# EAGLE design core XX8 THT (EAGLE 6.3)
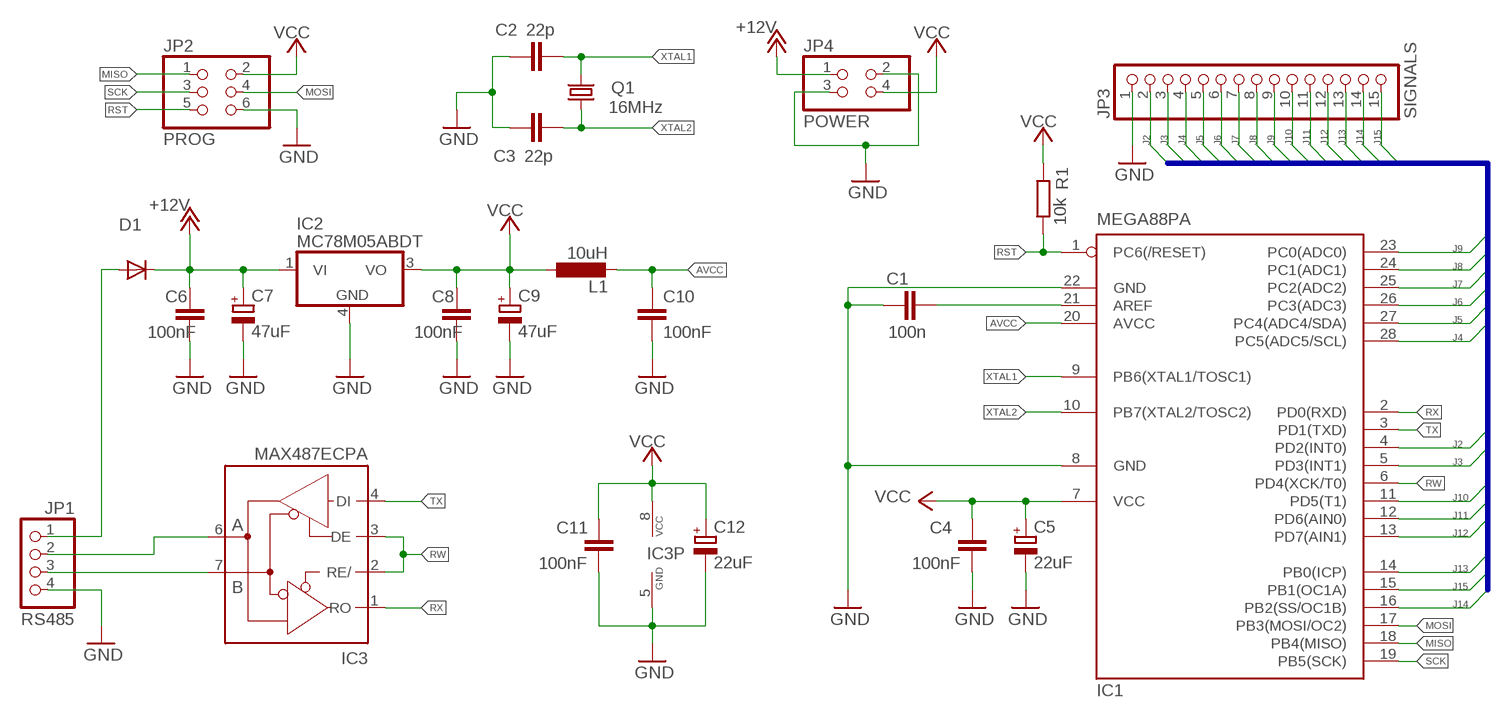
[diagram p0: schematic, sheet 1]

## Parts
C1  100n  C-EU025-024X044  [C025-024X044]
C2  22p  C-EU025-024X044  [C025-024X044]
C3  22p  C-EU025-024X044  [C025-024X044]
C4  100nF  C-EU025-025X050  [C025-025X050]
C5  22uF  CPOL-EUE2-5  [E2-5]
C6  100nF  C-EU025-025X050  [C025-025X050]
C7  47uF  CPOL-EUE2.5-6  [E2,5-6]
C8  100nF  C-EU025-025X050  [C025-025X050]
C9  47uF  CPOL-EUE2.5-6  [E2,5-6]
C10  100nF  C-EU025-025X050  [C025-025X050]
C11  100nF  C-EU025-025X050  [C025-025X050]
C12  22uF  CPOL-EUE2-5  [E2-5]
D1  1N4002  BAS15  [DO34-7]
IC1  MEGA88PA  MEGA8-P  [DIL28-3]
IC2  MC78M05ABDT  [DPACK_3]
IC3  MAX487ECPA  MAX481CPA  [DIL08]
JP1  RS485  PINHD-1X4  [1X04]
JP2  PROG  PINHD-2X3  [2X03]
JP3  SIGNALS  PINHD-1X15  [1X15]
JP4  POWER  PINHD-2X2  [2X02]
L1  10uH  L-EU0207/12  [0207/12]
Q1  16MHz  CRYSTALHC49S  [HC49/S]
R1  10k  R-EU_0204/2V  [0204V]

## Nets
+12V: C6.1 C7.+ D1.C IC2.1(VI) JP4.1
AVCC: C10.1 IC1.20(AVCC) L1.2
GND: C1.1 C2.1 C3.1 C4.2 C5.- C6.2 C7.- C8.2 C9.- C10.2 C11.2 C12.- IC1.8(GND) IC1.22(GND) IC2.4(GND) IC3.5(GND) JP1.4 JP2.6 JP3.1 JP4.2 JP4.3
J2: IC1.4(PD2(INT0)) JP3.2
J3: IC1.5(PD3(INT1)) JP3.3
J4: IC1.28(PC5(ADC5/SCL)) JP3.4
J5: IC1.27(PC4(ADC4/SDA)) JP3.5
J6: IC1.26(PC3(ADC3)) JP3.6
J7: IC1.25(PC2(ADC2)) JP3.7
J8: IC1.24(PC1(ADC1)) JP3.8
J9: IC1.23(PC0(ADC0)) JP3.9
J10: IC1.11(PD5(T1)) JP3.10
J11: IC1.12(PD6(AIN0)) JP3.11
J12: IC1.13(PD7(AIN1)) JP3.12
J13: IC1.14(PB0(ICP)) JP3.13
J14: IC1.16(PB2(SS/OC1B)) JP3.14
J15: IC1.15(PB1(OC1A)) JP3.15
MISO: IC1.18(PB4(MISO)) JP2.1
MOSI: IC1.17(PB3(MOSI/OC2)) JP2.4
N$2: C1.2 IC1.21(AREF)
N$3: D1.A JP1.1
N$4: IC3.7(B) JP1.3
N$5: IC3.6(A) JP1.2
RST: IC1.1(PC6(/RESET)) JP2.5 R1.1
RW: IC1.6(PD4(XCK/T0)) IC3.2(RE/) IC3.3(DE)
RX: IC1.2(PD0(RXD)) IC3.1(RO)
SCK: IC1.19(PB5(SCK)) JP2.3
TX: IC1.3(PD1(TXD)) IC3.4(DI)
VCC: C4.1 C5.+ C8.1 C9.+ C11.1 C12.+ IC1.7(VCC) IC2.3(VO) IC3.8(VCC) JP2.2 JP4.4 L1.1 R1.2
XTAL1: C2.2 IC1.9(PB6(XTAL1/TOSC1)) Q1.2
XTAL2: C3.2 IC1.10(PB7(XTAL2/TOSC2)) Q1.1

## Buses
J[2..15]

## Library data of the parts
C1-C4 C6 C8 C10 C11 = rcl:C-EU: CAPACITOR, European symbol
C5 C7 C9 C12 = rcl:CPOL-EU: POLARIZED CAPACITOR, European symbol
D1 = diode:BAS15: DIODE high speed
IC1 = atmel:MEGA8-P: MICROCONTROLLER 8 Kbytes FLASH, 1 kbytes SRAM, 512 bytes EEPROM, USART, 4-channel 10 bit ADC, 2-channel 8 bit ADC Pin compatible with Atmega48, ATMega88, ATMega168 Source: avr.lbr; OC_FARNELL: unknown; OC_NEWARK: unknown
IC2 = linear:MC78M: 500 mA Positive Voltage Regulators Source: Data sheet <http://www.onsemi.com/pub_link/Collateral/MC78M00-D.PDF>
IC3 = maxim:MAX481CPA: RS485 TRANSEIVER; MPN: MAX481CPA+; OC_FARNELL: unknown; OC_NEWARK: 99K3445
JP1 = pinhead:PINHD-1X4: PIN HEADER
JP2 = pinhead:PINHD-2X3: PIN HEADER
JP3 = pinhead:PINHD-1X15: PIN HEADER
JP4 = pinhead:PINHD-2X2: PIN HEADER
L1 = rcl:L-EU: INDUCTOR, European symbol
Q1 = crystal:CRYSTAL: CRYSTAL; OC_FARNELL: 1667008; OC_NEWARK: unknown
R1 = rcl:R-EU_: RESISTOR, European symbol

## Board
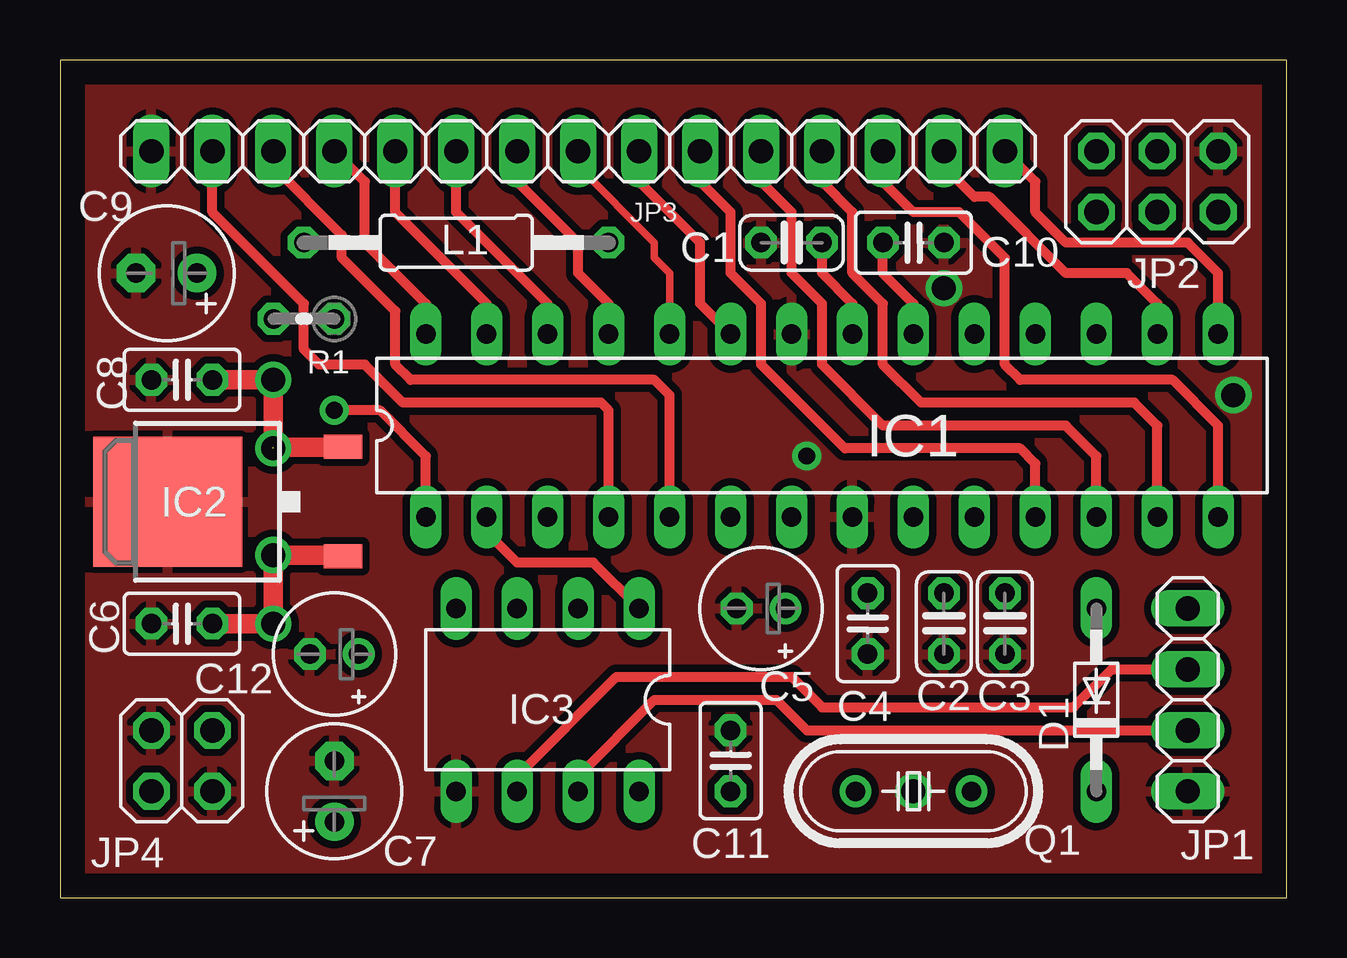
[diagram p1: board, top side]
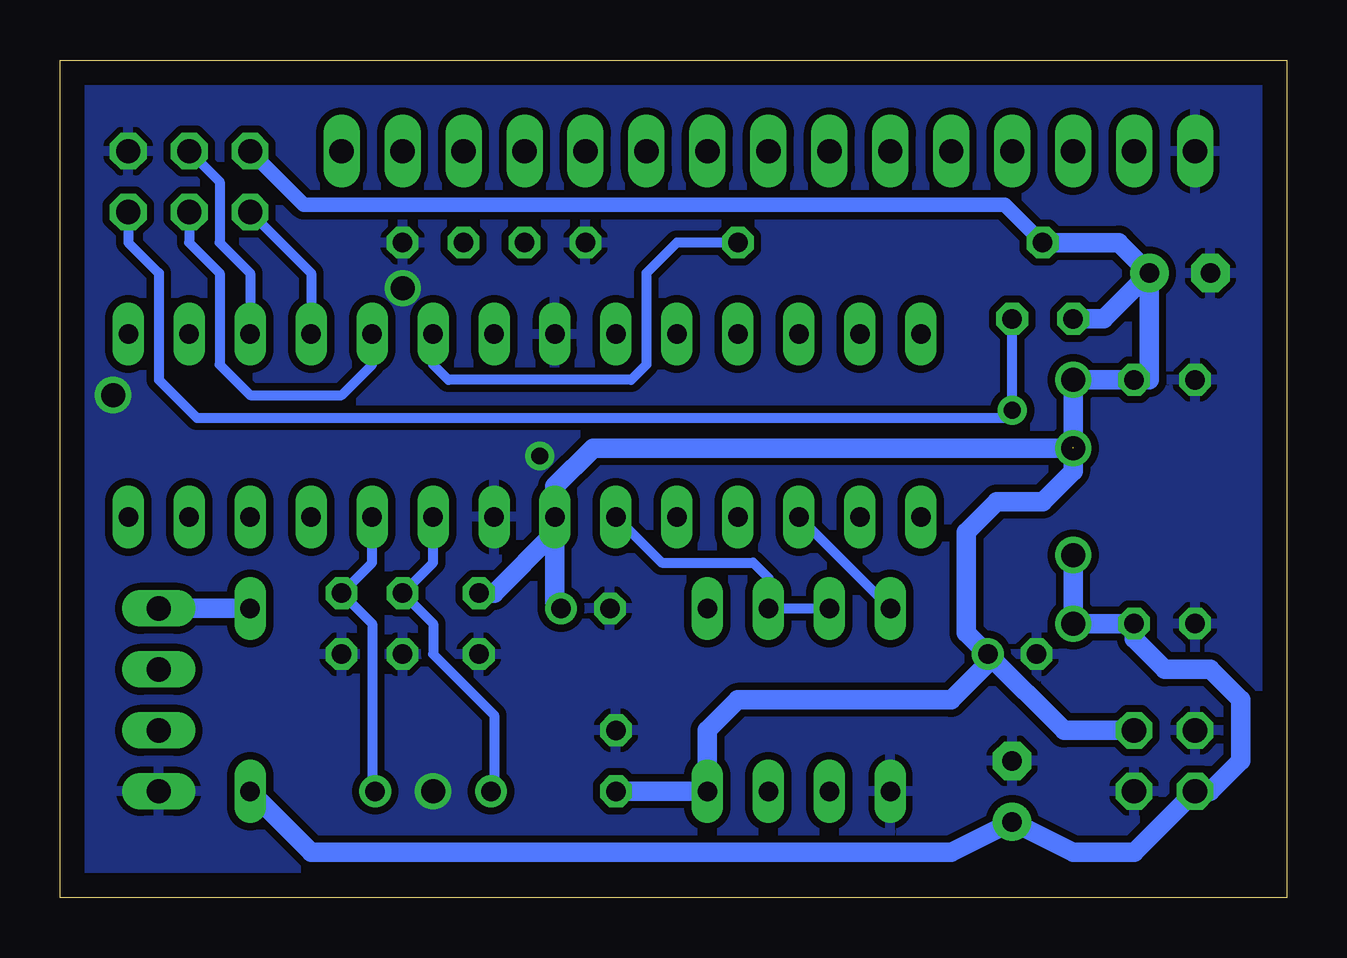
[diagram p2: board, bottom side, seen from below]

Size 51.1 x 34.91 mm. Coordinates in mm from the lower left corner, seen from the top.
Outline: 0,0 51.1,0 51.1,34.91 0,34.91 0,0
Copper layers (1*16): Top 0.035mm / dielectric 1.5mm / Bottom 0.035mm
Design rules: minimum track width 12mil, minimum drill 24mil, track to track 12mil, track to pad 12mil, pad to pad 12mil, via to via 12mil, smd to smd 8mil, copper to edge 40mil, drill to drill 12mil, minimum pad ring 10mil, minimum via ring 10mil, stop-mask expansion 4mil, vias tented up to drill 0mil, thermal gap 10mil

### Footprints (pad centres in the part's own frame; a part is rotated, then mirrored left to right if it is on the bottom)
C025-024X044 = drill 0.813 octagon: 1 -1.27,0; 2 1.27,0
C025-025X050 = drill 0.813 octagon: 1 -1.27,0; 2 1.27,0
E2-5 = drill 0.813 pad 1.27: + -1.016,0 | drill 0.813 pad 1.27 octagon: - 1.016,0
E2,5-6 = drill 0.813 pad 1.6: + -1.27,0 | drill 0.813 pad 1.6 octagon: - 1.27,0
DO34-7 = drill 0.813 long: A 3.81,0; C -3.81,0
DIL28-3 = drill 0.813 long: 1 -16.51,-3.81; 2 -13.97,-3.81; 3 -11.43,-3.81; 4 -8.89,-3.81; 5 -6.35,-3.81; 6 -3.81,-3.81; 7 -1.27,-3.81; 8 1.27,-3.81; 9 3.81,-3.81; 10 6.35,-3.81; 11 8.89,-3.81; 12 11.43,-3.81; 13 13.97,-3.81; 14 16.51,-3.81; 15 16.51,3.81; 16 13.97,3.81; 17 11.43,3.81; 18 8.89,3.81; 19 6.35,3.81; 20 3.81,3.81; 21 1.27,3.81; 22 -1.27,3.81; 23 -3.81,3.81; 24 -6.35,3.81; 25 -8.89,3.81; 26 -11.43,3.81; 27 -13.97,3.81; 28 -16.51,3.81
DPACK_3 = smd 1 x 1.6: 1 -2.28,-4.8; 3 2.28,-4.8 | smd 5.4 x 6.2: 4 0,2.5
DIL08 = drill 0.813 long: 1 -3.81,-3.81; 2 -1.27,-3.81; 3 1.27,-3.81; 4 3.81,-3.81; 5 3.81,3.81; 6 1.27,3.81; 7 -1.27,3.81; 8 -3.81,3.81
1X04 = drill 1.016 long: 1 -3.81,0; 2 -1.27,0; 3 1.27,0; 4 3.81,0
2X03 = drill 1.016 octagon: 1 -2.54,-1.27; 2 -2.54,1.27; 3 0,-1.27; 4 0,1.27; 5 2.54,-1.27; 6 2.54,1.27
1X15 = drill 1.016 long: 1 -17.78,0; 2 -15.24,0; 3 -12.7,0; 4 -10.16,0; 5 -7.62,0; 6 -5.08,0; 7 -2.54,0; 8 0,0; 9 2.54,0; 10 5.08,0; 11 7.62,0; 12 10.16,0; 13 12.7,0; 14 15.24,0; 15 17.78,0
2X02 = drill 1.016 octagon: 1 -1.27,-1.27; 2 -1.27,1.27; 3 1.27,-1.27; 4 1.27,1.27
0207/12 = drill 0.813 octagon: 1 -6.35,0; 2 6.35,0
HC49/S = drill 0.813: 1 -2.413,0; 2 2.413,0
0204V = drill 0.813 octagon: 1 -1.27,0; 2 1.27,0

### Placement (x,y rotation side)
C1  30.48,27.3 0 top
C2  36.83,11.43 90 top
C3  39.37,11.43 90 top
C4  33.66,11.43 270 top
C5  29.21,12.06 180 top
C6  5.08,11.43 180 top
C7  11.43,4.45 90 top
C8  5.08,21.59 180 top
C9  4.45,26.04 180 top
C10  35.56,27.3 0 top
C11  27.94,5.71 90 top
C12  11.43,10.16 180 top
D1  43.18,8.26 90 top
IC1  31.75,19.68 0 top
IC2  6.99,16.51 90 top
IC3  20.32,8.26 180 top
JP1  46.99,8.26 270 top
JP2  45.72,29.84 0 top
JP3  21.59,31.11 0 top
JP4  5.08,5.71 0 top
L1  16.51,27.3 0 top
Q1  35.56,4.45 180 top
R1  10.16,24.13 180 top

### Tracks (layer width: path | path; a pad name or v marks a point on that pad's centre or on a via)
+12V  (via drill 1)
  Top 0.813: C6.1 v8.89,11.43 v8.89,14.29 11.79,14.29 IC2.1
  Bottom 0.813: D1.C 40.64,1.91 13.97,1.91 C7.+ 8.89,1.91 6.35,1.91 JP4.1 3.17,4.45 1.91,5.71 1.91,8.26 3.17,9.53 5.08,9.53 6.35,10.79 C6.1 v8.89,11.43 v8.89,14.29
AVCC
  Top 0.305: IC1.20 35.56,24.77
  Top 0.406: 35.56,24.77 34.29,26.04 C10.1
  Bottom 0.406: L1.2 25.4,27.3 26.67,26.04 26.67,22.23 27.3,21.59 34.92,21.59 35.56,22.23 IC1.20
GND  (via drill 0.7, 1)
  other vias: 36.83,25.4 35.56,4.45 48.9,20.95 31.11,18.41
  pour Bottom (isolate 0.305): -0.64,-0.64 -0.64,35.56 52.7,35.56 52.7,-0.64
  pour Top (isolate 0.305): -0.64,-0.64 -0.64,35.56 52.7,35.56 52.7,-0.64
J2
  Top 0.406: IC1.4 22.86,20.32 22.54,20.64 14.29,20.64 12.7,22.23 10.79,22.23 10.16,22.86 10.16,24.77 6.35,28.57 JP3.2
J3
  Top 0.406: IC1.5 25.4,20.95 24.77,21.59 14.61,21.59 13.97,22.23 13.97,24.45 11.75,26.67 11.75,27.62 8.89,30.48 JP3.3
J4
  Top 0.406: IC1.28 15.24,24.77 12.7,27.3 12.7,29.84 JP3.4
J5
  Top 0.406: IC1.27 17.78,24.77 13.97,28.57 JP3.5
J6
  Top 0.406: IC1.26 20.32,24.77 16.51,28.57 JP3.6
J7
  Top 0.305: IC1.25 22.86,24.77
  Top 0.406: 22.86,24.77 21.59,26.04 21.59,27.3 19.05,29.84 JP3.7
J8
  Top 0.305: IC1.24 25.4,26.04 24.77,26.67 24.77,27.3 21.59,30.48
  Top 0.406: 21.59,30.48 JP3.8
J9
  Top 0.406: IC1.23 26.67,24.77 26.67,27.3 24.13,29.84 JP3.9
J10
  Top 0.406: JP3.10 26.67,29.84 27.94,28.57 27.94,26.04 29.21,24.77 29.21,22.23 32.7,18.73 40.01,18.73 40.64,18.1 IC1.11
J11
  Top 0.305: 29.21,29.84 JP3.11
  Top 0.406: IC1.12 43.18,18.41 41.91,19.68 34.29,19.68 31.75,22.23 31.75,24.77 30.48,26.04 30.48,28.57 29.21,29.84
J12
  Top 0.406: IC1.13 45.72,19.68 44.77,20.64 35.88,20.64 34.29,22.23 34.29,24.77 33.02,26.04 33.02,28.57 31.75,29.84 JP3.12
J13
  Top 0.406: IC1.14 48.26,19.68 46.35,21.59 40.01,21.59 39.37,22.23 39.37,26.67 37.47,28.57 35.56,28.57 34.29,29.84 JP3.13
J14
  Top 0.406: IC1.16 45.72,24.77 44.45,26.04 41.91,26.04 38.73,29.21 38.1,29.21 36.83,30.48 JP3.14
J15
  Top 0.406: IC1.15 48.26,26.04 46.99,27.3 41.91,27.3 40.64,28.57 40.64,29.84 JP3.15
MISO
  Bottom 0.406: JP2.1 40.64,26.04 IC1.18
MOSI
  Bottom 0.406: JP2.4 44.45,29.84 44.45,27.3 43.18,26.04 IC1.17
N$2
  Top 0.406: IC1.21 33.02,24.77 31.75,26.04 C1.2
N$3
  Bottom 0.813: JP1.1 D1.A
N$4
  Top 0.406: IC3.7 21.59,5.08 24.77,8.26 29.84,8.26 31.11,6.99 JP1.3
N$5
  Top 0.406: IC3.6 19.05,5.08 23.18,9.21 30.48,9.21 31.75,7.94 42.23,7.94 43.81,9.53 JP1.2
RST  (via drill 0.7)
  Top 0.406: IC1.1 15.24,18.41 13.34,20.32 v11.43,20.32
  Bottom 0.406: R1.1 v11.43,20.32 11.75,20 45.4,20 46.99,21.59 46.99,26.04 48.26,27.3 JP2.5
RW
  Bottom 0.406: IC1.6 26.04,13.97 22.23,13.97 21.59,13.34 IC3.2 IC3.3
RX
  Top 0.406: IC3.1 22.23,13.97 19.05,13.97 17.78,15.24 IC1.2
SCK
  Bottom 0.406: JP2.3 45.72,27.3 44.45,26.04 44.45,22.23 43.18,20.95 39.37,20.95 38.1,22.23 IC1.19
TX
  Bottom 0.406: IC1.3 IC3.4
VCC  (via drill 1)  (1 unrouted)
  Top 0.813: IC2.3 8.89,18.79 | 8.89,19.05 v8.89,21.59 C8.1
  Bottom 0.61: JP2.2 40.96,28.89 11.75,28.89 L1.1
  Bottom 0.813: C12.+ 12.45,9.78 13.97,8.26 22.86,8.26 24.13,6.99 IC3.8 C11.1 | v8.89,21.59 C8.1 | v8.89,21.59 v8.89,18.73 | v8.89,18.73 8.89,17.78 10.16,16.51 12.06,16.51 13.34,15.24 13.34,11.05 C12.+ | JP4.4 9.27,6.99 C12.+ | R1.2 7.62,24.13 C9.+ | v8.89,21.59 5.71,21.59 C9.+ | L1.1 6.99,27.3 C9.+ | C5.+ 30.48,12.32 30.48,15.24 | 30.48,15.24 IC1.7 30.48,17.14 28.89,18.73 v8.89,18.73 | C4.1 33.02,12.7 30.48,15.24
XTAL1
  Bottom 0.406: IC1.9 35.56,13.97 C2.2 35.56,11.43 35.56,10.16 33.02,7.62 33.02,4.57 Q1.2
XTAL2
  Bottom 0.406: IC1.10 38.1,13.97 C3.2 38.1,11.43 38.1,4.57 Q1.1